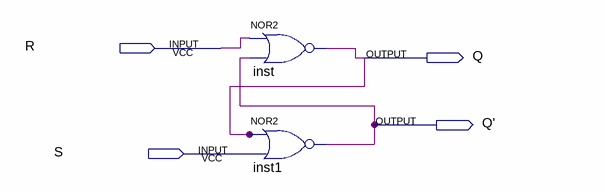
[diagram p0: schematic sheet]
// Quartus schematic nor.bdf as structural Verilog: 2 symbols, 4 pins
module \nor  (
  input  R,
  input  S,
  output Q,
  output \Q' 
);

  nor inst (Q, R, \Q' );
  nor inst1 (\Q' , Q, S);
endmodule
